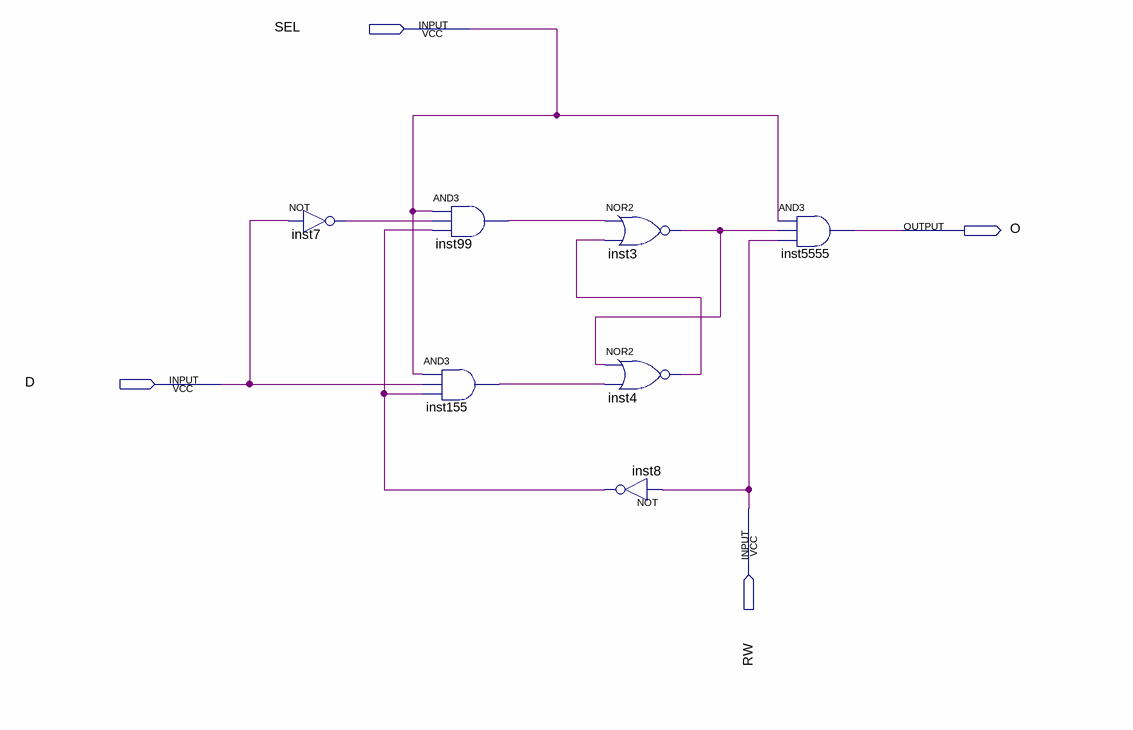
[diagram p0: schematic sheet]
// Quartus schematic ci_74189.bdf as structural Verilog: 7 symbols, 4 pins
module ci_74189 (
  input  SEL,
  input  D,
  input  RW,
  output O
);

  wire inst3_out, inst4_out, inst7_out, inst8_out, inst99_out, inst155_out;

  not inst7 (inst7_out, D);
  and inst99 (inst99_out, SEL, inst7_out, inst8_out);
  and inst155 (inst155_out, SEL, D, inst8_out);
  nor inst3 (inst3_out, inst99_out, inst4_out);
  nor inst4 (inst4_out, inst3_out, inst155_out);
  not inst8 (inst8_out, RW);
  and inst5555 (O, SEL, inst3_out, RW);
endmodule
